# EAGLE design rc_switch_dualsided_with_fet_driver_2 (EAGLE 7.2.0)
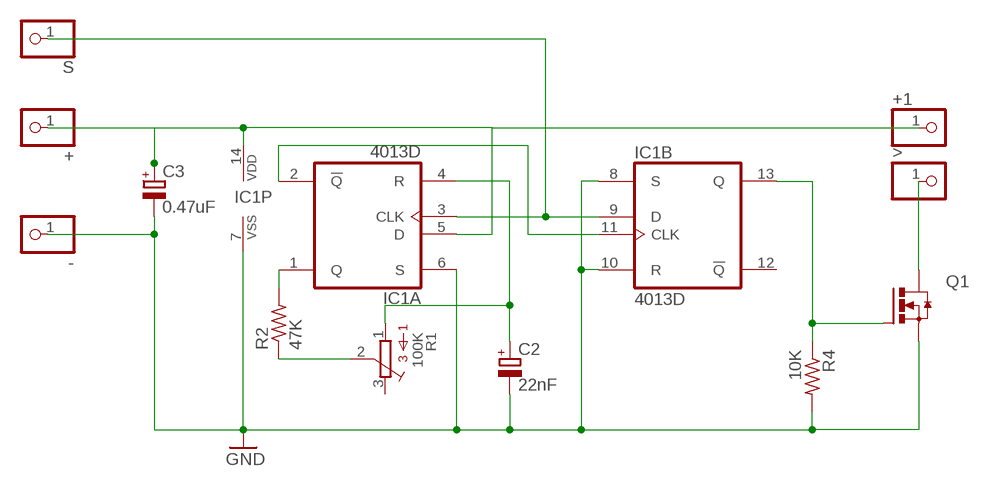
[diagram p0: schematic, sheet 1]

## Parts
+  PINHD-1X1  [1X01]
+1  PINHD-1X1  [1X01]
-  PINHD-1X1  [1X01]
>  PINHD-1X1  [1X01]
C2  22nF  CPOL-EUA  [PANASONIC_A]
C3  0.47uF  CPOL-EUA  [PANASONIC_A]
IC1  4013D  [SO14]
Q1  HUF76629D3ST_F085D-PAK_TO252  [D-PAK_TO252]
R1  100K  3386-P  [3386P]
R2  47K  R-US_R0805W  [R0805W]
R4  10K  R-US_R0805W  [R0805W]
S  PINHD-1X1  [1X01]

## Nets
GND: -.1 C2.- C3.- IC1.6(A:S) IC1.7(P:VSS) IC1.8(B:S) IC1.10(B:R) Q1.3(S) R4.2
N$1: IC1.1(A:Q) R2.2
N$2: R1.2 R2.1
N$3: C2.+ IC1.4(A:R) R1.1
N$8: IC1.2(A:!Q) IC1.11(B:CLK)
OUT-: >.1 Q1.4(D)
OUTPUT: IC1.13(B:Q) Q1.1(G) R4.1
SIG_IN: IC1.3(A:CLK) IC1.9(B:D) S.1
VDD: +1.1 +.1 C3.+ IC1.5(A:D) IC1.14(P:VDD)
Unconnected: IC1.12(B:!Q) R1.3

## Library data of the parts
+ +1 - > S = pinhead:PINHD-1X1: PIN HEADER
C2 C3 = resistor:CPOL-EU: POLARIZED CAPACITOR, European symbol
IC1 = 40xx:4013: Dual D FLIP FLOP, set/reset
Q1 = nervus:HUF76629D3ST_F085: N-Channel Logic Level UltraFET Power MOSFET 100 V, 20 A, 52 mΩ Datasheet <https://www.fairchildsemi.com/datasheets/HU/HUF76629D3S.pdf>
R1 = bourns:3386-: 3386 Series 3/8" Square Trimmer
R2 R4 = resistor:R-US_: RESISTOR, American symbol

## Board
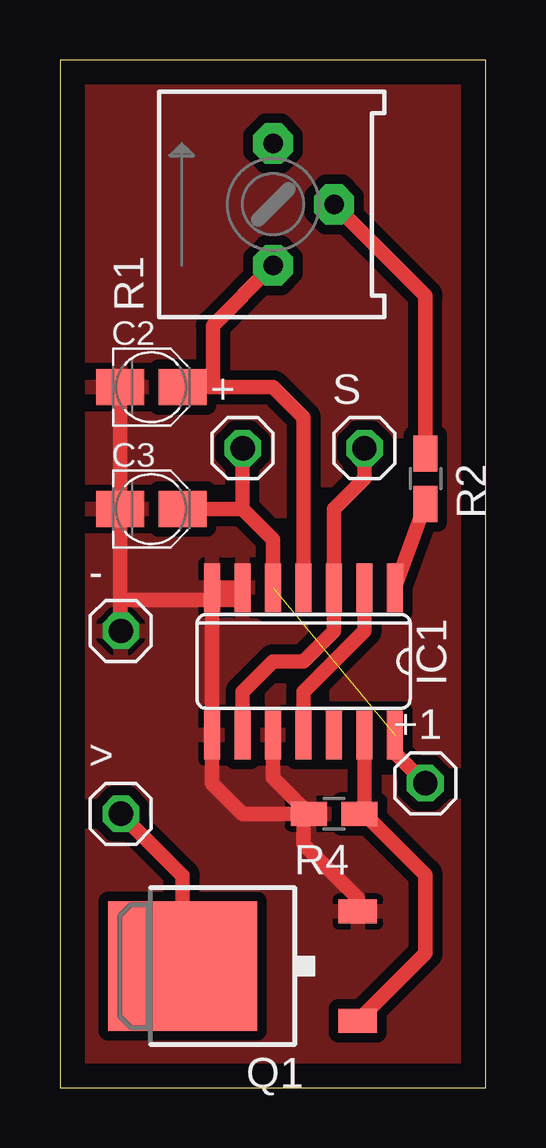
[diagram p1: board, top side]

Size 17.76 x 42.85 mm. Coordinates in mm from the lower left corner, seen from the top.
Outline: 0,0 17.76,0 17.76,42.85 0,42.85 0,0
Copper layers (1*16): Top 0.035mm / dielectric 1.5mm / Bottom 0.035mm
Design rules "default *": minimum track width 36mil, minimum drill 24mil, track to track 16mil, track to pad 16mil, pad to pad 16mil, via to via 16mil, smd to smd 16mil, copper to edge 40mil, drill to drill 8mil, minimum pad ring 10mil, minimum via ring 8mil, stop-mask expansion 4mil, vias tented up to drill 0mil, thermal gap 10mil

### Footprints (pad centres in the part's own frame; a part is rotated, then mirrored left to right if it is on the bottom)
1X01 = drill 1.016 octagon: 1 0,0
PANASONIC_A = smd 2 x 1.5: + 1.3,0; - -1.3,0
SO14 = smd 0.66 x 2.032: 1 -3.81,-3.073; 2 -2.54,-3.073; 3 -1.27,-3.073; 4 0,-3.073; 5 1.27,-3.073; 6 2.54,-3.073; 7 3.81,-3.073; 8 3.81,3.073; 9 2.54,3.073; 10 1.27,3.073; 11 0,3.073; 12 -1.27,3.073; 13 -2.54,3.073; 14 -3.81,3.073
D-PAK_TO252 = smd 1 x 1.6: 1 -2.28,-4.8; 3 2.28,-4.8 | smd 5.4 x 6.2: 4 0,2.5
3386P = drill 0.813 pad 1.676 octagon: 1 -2.54,0; 2 0,-2.54; 3 2.54,0
R0805W = smd 1.5 x 1: 1 -1.052,0; 2 1.052,0

### Placement (x,y rotation side)
+  7.62,26.67 0 top
+1  15.24,12.7 0 top
-  2.54,19.05 0 top
>  2.54,11.43 0 top
C2  3.81,29.21 0 top
C3  3.81,24.13 0 top
IC1  10.16,17.78 180 top
Q1  7.62,5.08 90 top
R1  8.89,36.83 90 top
R2  15.24,25.4 270 top
R4  11.43,11.43 180 top
S  12.7,26.67 0 top

### Tracks (layer width: path | path; a pad name or v marks a point on that pad's centre or on a via)
GND
  Top 0.61: IC1.6 IC1.7 IC1.8 6.35,12.7 7.62,11.43 R4.2 | IC1.10 8.89,12.92 R4.2 | C2.- C3.- 2.51,20.35 | 2.51,20.35 -.1 | 2.51,20.35 7.59,20.35 7.62,20.32 | Q1.3 12.42,7.9 10.16,10.16 10.16,11.21 R4.2
  pour Top: 0,43.18 17.78,43.18 17.78,0 0,0
N$1
  Top 0.61: R2.2 IC1.1
N$2
  Top 0.61: R2.1 15.24,33.02 R1.2
N$3
  Top 0.61: R1.1 6.38,31.78 6.38,29.24 6.35,29.21 | 10.16,20.32 IC1.4 10.16,27.94 8.89,29.21 6.35,29.21 | C2.+ 6.35,29.21
N$8
  Top 0.61: IC1.11 10.16,16.51 12.7,19.05 IC1.2
OUT-
  Top 0.61: Q1.4 5.12,8.85 >.1
OUTPUT
  Top 0.61: IC1.13 12.7,11.65 R4.1 12.7,11.43 15.24,8.89 15.24,5.62 Q1.1
SIG_IN
  Top 0.61: IC1.9 7.62,16.51 8.89,17.78 10.16,17.78 11.43,19.05 IC1.3 11.43,24.13 12.7,25.4 S.1
VDD  (1 unrouted)
  Top 0.61: IC1.14 13.97,13.97 +1.1 | C3.+ 7.62,24.13 | 7.62,24.13 8.89,22.86 IC1.5 | 7.62,24.13 +.1